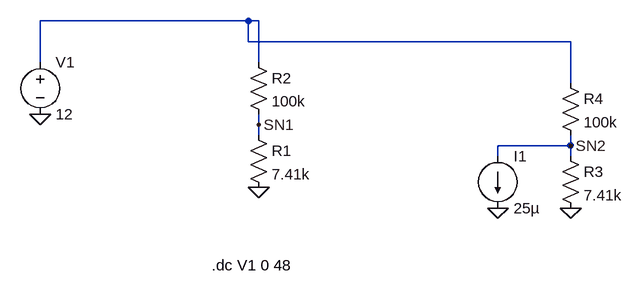
[diagram p0: schematic Zener.asc]
Zener.asc, the LTspice schematic file:
Version 4
SHEET 1 1064 680
WIRE 480 144 160 144
WIRE 496 144 480 144
WIRE 480 176 480 144
WIRE 976 176 480 176
WIRE 160 208 160 144
WIRE 496 208 496 144
WIRE 976 240 976 176
WIRE 496 304 496 288
WIRE 496 320 496 304
WIRE 976 336 976 320
WIRE 976 336 864 336
WIRE 864 352 864 336
WIRE 976 352 976 336
FLAG 160 288 0
FLAG 864 432 0
FLAG 496 400 0
FLAG 496 304 SN1
FLAG 976 432 0
FLAG 976 336 SN2
SYMBOL current 864 352 R0
SYMATTR InstName I1
SYMATTR Value 25µ
SYMBOL res 480 304 R0
SYMATTR InstName R1
SYMATTR Value 7.41k
SYMBOL res 480 192 R0
SYMATTR InstName R2
SYMATTR Value 100k
SYMBOL voltage 160 192 R0
SYMATTR InstName V1
SYMATTR Value 12
SYMBOL res 960 336 R0
SYMATTR InstName R3
SYMATTR Value 7.41k
SYMBOL res 960 224 R0
SYMATTR InstName R4
SYMATTR Value 100k
TEXT 424 520 Left 2 !.dc V1 0 48

The netlist it stands for:
* Zener.asc
I1 SN2 0 25µ
R1 SN1 0 7.41k
R2 N001 SN1 100k
V1 N001 0 12
R3 SN2 0 7.41k
R4 N001 SN2 100k
.dc V1 0 48
.backanno
.end